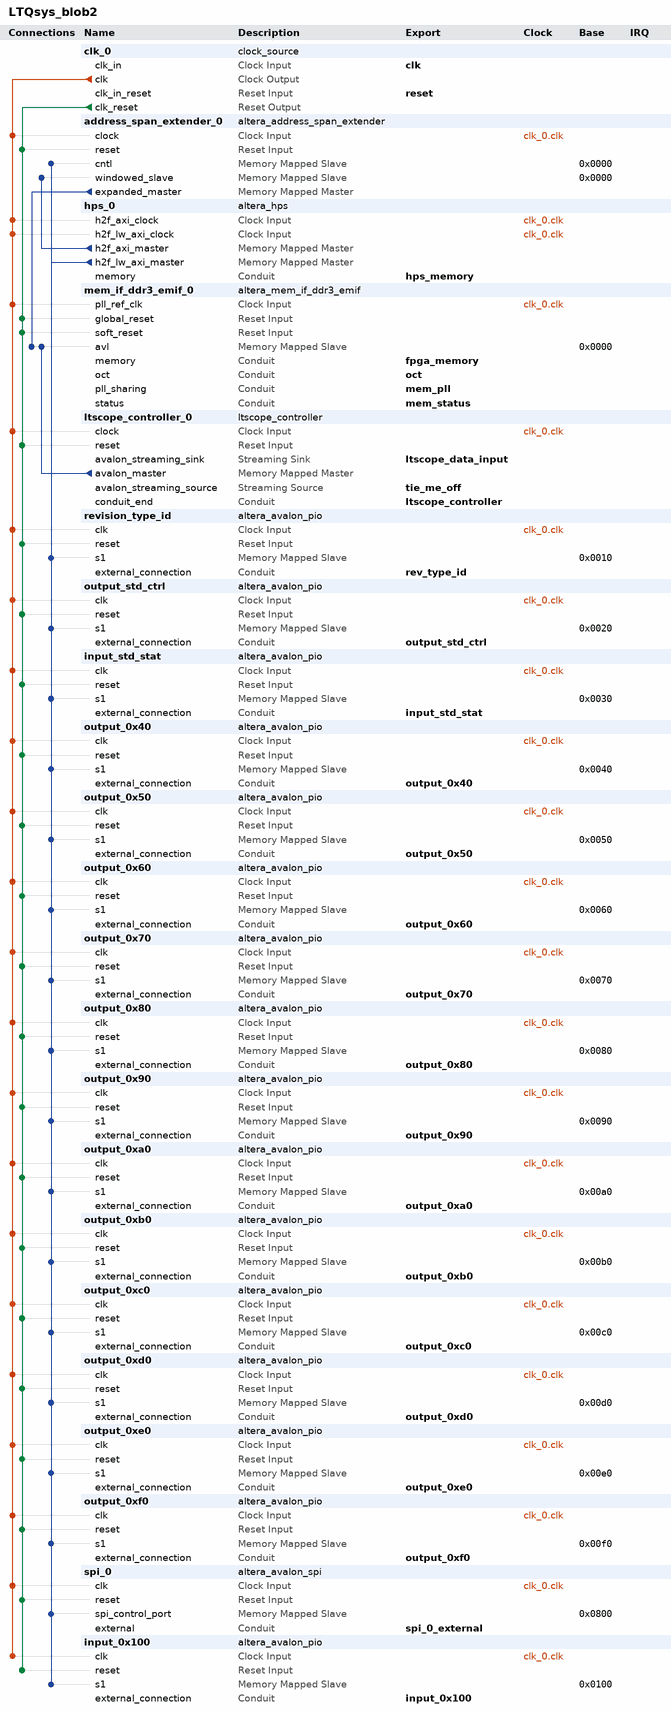
[diagram p0: system contents]
# Platform Designer (Qsys) system LTQsys_blob2, Cyclone V 5CSXFC6D6F31C8ES
# Parameters at their usual value, and those the tool derives, are not listed.
package require -exact qsys 14.1
create_system LTQsys_blob2
set_project_property DEVICE_FAMILY {Cyclone V}
set_project_property DEVICE 5CSXFC6D6F31C8ES

add_instance clk_0 clock_source 14.1
set_instance_parameter_value clk_0 clockFrequency 50000000

add_instance address_span_extender_0 altera_address_span_extender 14.1
set_instance_parameter_value address_span_extender_0 BURSTCOUNT_WIDTH 1
set_instance_parameter_value address_span_extender_0 DATA_WIDTH 32
set_instance_parameter_value address_span_extender_0 MASTER_ADDRESS_DEF 0
set_instance_parameter_value address_span_extender_0 MAX_PENDING_READS 1
set_instance_parameter_value address_span_extender_0 SLAVE_ADDRESS_WIDTH 26
set_instance_parameter_value address_span_extender_0 SUB_WINDOW_COUNT 2
set_instance_parameter_value address_span_extender_0 TERMINATE_SLAVE_PORT false

add_instance hps_0 altera_hps 14.1
set_instance_parameter_value hps_0 EMAC1_Mode N/A
set_instance_parameter_value hps_0 EMAC1_PinMuxing Unused
set_instance_parameter_value hps_0 F2SCLK_COLDRST_Enable false
set_instance_parameter_value hps_0 F2SCLK_DBGRST_Enable false
set_instance_parameter_value hps_0 F2SCLK_WARMRST_Enable false
set_instance_parameter_value hps_0 F2SINTERRUPT_Enable false
set_instance_parameter_value hps_0 F2S_Width 0
set_instance_parameter_value hps_0 FPGA_PERIPHERAL_OUTPUT_CLOCK_FREQ_EMAC0_GTX_CLK 100
set_instance_parameter_value hps_0 FPGA_PERIPHERAL_OUTPUT_CLOCK_FREQ_EMAC0_MD_CLK 100
set_instance_parameter_value hps_0 FPGA_PERIPHERAL_OUTPUT_CLOCK_FREQ_EMAC1_GTX_CLK 100
set_instance_parameter_value hps_0 FPGA_PERIPHERAL_OUTPUT_CLOCK_FREQ_EMAC1_MD_CLK 100
set_instance_parameter_value hps_0 HPS_PROTOCOL DDR3
set_instance_parameter_value hps_0 I2C0_Mode N/A
set_instance_parameter_value hps_0 I2C0_PinMuxing Unused
set_instance_parameter_value hps_0 I2C1_Mode N/A
set_instance_parameter_value hps_0 I2C1_PinMuxing Unused
set_instance_parameter_value hps_0 LWH2F_Enable true
set_instance_parameter_value hps_0 MEM_BANKADDR_WIDTH 3
set_instance_parameter_value hps_0 MEM_CLK_FREQ 400.0
set_instance_parameter_value hps_0 MEM_COL_ADDR_WIDTH 10
set_instance_parameter_value hps_0 MEM_DQ_WIDTH 32
set_instance_parameter_value hps_0 MEM_DRV_STR RZQ/7
set_instance_parameter_value hps_0 MEM_ROW_ADDR_WIDTH 15
set_instance_parameter_value hps_0 MEM_RTT_NOM RZQ/4
set_instance_parameter_value hps_0 MEM_RTT_WR RZQ/4
set_instance_parameter_value hps_0 MEM_TCL 11
set_instance_parameter_value hps_0 MEM_TFAW_NS 30.0
set_instance_parameter_value hps_0 MEM_TRAS_NS 35.0
set_instance_parameter_value hps_0 MEM_TRCD_NS 13.75
set_instance_parameter_value hps_0 MEM_TRFC_NS 260.0
set_instance_parameter_value hps_0 MEM_TRP_NS 13.75
set_instance_parameter_value hps_0 MEM_VENDOR JEDEC
set_instance_parameter_value hps_0 MEM_WTCL 8
set_instance_parameter_value hps_0 QSPI_Mode N/A
set_instance_parameter_value hps_0 QSPI_PinMuxing Unused
set_instance_parameter_value hps_0 REF_CLK_FREQ 25.0
set_instance_parameter_value hps_0 S2F_Width 2
set_instance_parameter_value hps_0 SDIO_Mode N/A
set_instance_parameter_value hps_0 SDIO_PinMuxing Unused
set_instance_parameter_value hps_0 SPIM1_Mode N/A
set_instance_parameter_value hps_0 SPIM1_PinMuxing Unused
set_instance_parameter_value hps_0 STM_Enable false
set_instance_parameter_value hps_0 TIMING_BOARD_AC_SKEW 0.03
set_instance_parameter_value hps_0 TIMING_BOARD_AC_TO_CK_SKEW 0.0
set_instance_parameter_value hps_0 TIMING_BOARD_DQ_TO_DQS_SKEW 0.0
set_instance_parameter_value hps_0 TIMING_BOARD_MAX_CK_DELAY 0.03
set_instance_parameter_value hps_0 TIMING_BOARD_MAX_DQS_DELAY 0.02
set_instance_parameter_value hps_0 TIMING_BOARD_SKEW_BETWEEN_DQS 0.08
set_instance_parameter_value hps_0 TIMING_BOARD_SKEW_CKDQS_DIMM_MAX 0.16
set_instance_parameter_value hps_0 TIMING_BOARD_SKEW_CKDQS_DIMM_MIN 0.09
set_instance_parameter_value hps_0 TIMING_BOARD_SKEW_WITHIN_DQS 0.01
set_instance_parameter_value hps_0 TIMING_TDH 65
set_instance_parameter_value hps_0 TIMING_TDQSCK 255
set_instance_parameter_value hps_0 TIMING_TDQSQ 125
set_instance_parameter_value hps_0 TIMING_TDS 30
set_instance_parameter_value hps_0 TIMING_TIH 140
set_instance_parameter_value hps_0 TIMING_TIS 180
set_instance_parameter_value hps_0 TIMING_TQSH 0.4
set_instance_parameter_value hps_0 UART0_Mode N/A
set_instance_parameter_value hps_0 UART0_PinMuxing Unused
set_instance_parameter_value hps_0 USB1_Mode N/A
set_instance_parameter_value hps_0 USB1_PinMuxing Unused
set_instance_parameter_value hps_0 desired_cfg_clk_mhz 100.0
set_instance_parameter_value hps_0 desired_qspi_clk_mhz 400.0

add_instance mem_if_ddr3_emif_0 altera_mem_if_ddr3_emif 14.1
set_instance_parameter_value mem_if_ddr3_emif_0 AVL_MAX_SIZE 4
set_instance_parameter_value mem_if_ddr3_emif_0 CALIBRATION_MODE Full
set_instance_parameter_value mem_if_ddr3_emif_0 CPORT_TYPE_PORT Bidirectional,Bidirectional,Bidirectional,Bidirectional,Bidirectional,Bidirectional
set_instance_parameter_value mem_if_ddr3_emif_0 EXPORT_AFI_HALF_CLK false
set_instance_parameter_value mem_if_ddr3_emif_0 HARD_EMIF false
set_instance_parameter_value mem_if_ddr3_emif_0 MEM_BANKADDR_WIDTH 3
set_instance_parameter_value mem_if_ddr3_emif_0 MEM_CLK_FREQ 300.0
set_instance_parameter_value mem_if_ddr3_emif_0 MEM_CLK_FREQ_MAX 400.0
set_instance_parameter_value mem_if_ddr3_emif_0 MEM_COL_ADDR_WIDTH 10
set_instance_parameter_value mem_if_ddr3_emif_0 MEM_DQ_WIDTH 32
set_instance_parameter_value mem_if_ddr3_emif_0 MEM_FORMAT DISCRETE
set_instance_parameter_value mem_if_ddr3_emif_0 MEM_ROW_ADDR_WIDTH 15
set_instance_parameter_value mem_if_ddr3_emif_0 MEM_TCL 6
set_instance_parameter_value mem_if_ddr3_emif_0 MEM_TFAW_NS 50.0
set_instance_parameter_value mem_if_ddr3_emif_0 MEM_TRAS_NS 37.5
set_instance_parameter_value mem_if_ddr3_emif_0 MEM_TRCD_NS 15.0
set_instance_parameter_value mem_if_ddr3_emif_0 MEM_TRFC_NS 300.0
set_instance_parameter_value mem_if_ddr3_emif_0 MEM_TRP_NS 15.0
set_instance_parameter_value mem_if_ddr3_emif_0 MEM_TRRD_NS 13.2
set_instance_parameter_value mem_if_ddr3_emif_0 MEM_TRTP_NS 13.2
set_instance_parameter_value mem_if_ddr3_emif_0 MEM_TWTR 4
set_instance_parameter_value mem_if_ddr3_emif_0 MEM_VENDOR JEDEC
set_instance_parameter_value mem_if_ddr3_emif_0 MEM_WTCL 5
set_instance_parameter_value mem_if_ddr3_emif_0 PLL_LOCATION Top_Bottom
set_instance_parameter_value mem_if_ddr3_emif_0 POWER_OF_TWO_BUS false
set_instance_parameter_value mem_if_ddr3_emif_0 PRIORITY_PORT 1,1,1,1,1,1
set_instance_parameter_value mem_if_ddr3_emif_0 RATE Half
set_instance_parameter_value mem_if_ddr3_emif_0 REF_CLK_FREQ 50.0
set_instance_parameter_value mem_if_ddr3_emif_0 SPEED_GRADE 8
set_instance_parameter_value mem_if_ddr3_emif_0 TIMING_BOARD_AC_SKEW 0.03
set_instance_parameter_value mem_if_ddr3_emif_0 TIMING_BOARD_AC_TO_CK_SKEW 0.0
set_instance_parameter_value mem_if_ddr3_emif_0 TIMING_BOARD_DQ_TO_DQS_SKEW 0.0
set_instance_parameter_value mem_if_ddr3_emif_0 TIMING_BOARD_MAX_CK_DELAY 0.03
set_instance_parameter_value mem_if_ddr3_emif_0 TIMING_BOARD_MAX_DQS_DELAY 0.03
set_instance_parameter_value mem_if_ddr3_emif_0 TIMING_BOARD_SKEW_BETWEEN_DQS 0.08
set_instance_parameter_value mem_if_ddr3_emif_0 TIMING_BOARD_SKEW_CKDQS_DIMM_MAX 0.0
set_instance_parameter_value mem_if_ddr3_emif_0 TIMING_BOARD_SKEW_CKDQS_DIMM_MIN 0.0
set_instance_parameter_value mem_if_ddr3_emif_0 TIMING_BOARD_SKEW_WITHIN_DQS 0.01
set_instance_parameter_value mem_if_ddr3_emif_0 TIMING_TDH 150
set_instance_parameter_value mem_if_ddr3_emif_0 TIMING_TDQSCK 400
set_instance_parameter_value mem_if_ddr3_emif_0 TIMING_TDQSQ 200
set_instance_parameter_value mem_if_ddr3_emif_0 TIMING_TDQSS 0.25
set_instance_parameter_value mem_if_ddr3_emif_0 TIMING_TDS 75
set_instance_parameter_value mem_if_ddr3_emif_0 TIMING_TDSH 0.2
set_instance_parameter_value mem_if_ddr3_emif_0 TIMING_TDSS 0.2
set_instance_parameter_value mem_if_ddr3_emif_0 TIMING_TIH 275
set_instance_parameter_value mem_if_ddr3_emif_0 TIMING_TIS 200
set_instance_parameter_value mem_if_ddr3_emif_0 TIMING_TQSH 0.38
set_instance_parameter_value mem_if_ddr3_emif_0 USER_DEBUG_LEVEL 1

add_instance ltscope_controller_0 ltscope_controller 2.0
set_instance_parameter_value ltscope_controller_0 ADDRESS_DEPTH 29

add_instance revision_type_id altera_avalon_pio 14.1
set_instance_parameter_value revision_type_id direction Input
set_instance_parameter_value revision_type_id width 32

add_instance output_std_ctrl altera_avalon_pio 14.1
set_instance_parameter_value output_std_ctrl direction Output
set_instance_parameter_value output_std_ctrl width 32

add_instance input_std_stat altera_avalon_pio 14.1
set_instance_parameter_value input_std_stat direction Input
set_instance_parameter_value input_std_stat width 32

add_instance output_0x40 altera_avalon_pio 14.1
set_instance_parameter_value output_0x40 direction Output
set_instance_parameter_value output_0x40 width 32

add_instance output_0x50 altera_avalon_pio 14.1
set_instance_parameter_value output_0x50 direction Output
set_instance_parameter_value output_0x50 width 32

add_instance output_0x60 altera_avalon_pio 14.1
set_instance_parameter_value output_0x60 direction Output
set_instance_parameter_value output_0x60 width 32

add_instance output_0x70 altera_avalon_pio 14.1
set_instance_parameter_value output_0x70 direction Output
set_instance_parameter_value output_0x70 width 32

add_instance output_0x80 altera_avalon_pio 14.1
set_instance_parameter_value output_0x80 direction Output
set_instance_parameter_value output_0x80 width 32

add_instance output_0x90 altera_avalon_pio 14.1
set_instance_parameter_value output_0x90 direction Output
set_instance_parameter_value output_0x90 width 32

add_instance output_0xa0 altera_avalon_pio 14.1
set_instance_parameter_value output_0xa0 direction Output
set_instance_parameter_value output_0xa0 width 32

add_instance output_0xb0 altera_avalon_pio 14.1
set_instance_parameter_value output_0xb0 direction Output
set_instance_parameter_value output_0xb0 width 32

add_instance output_0xc0 altera_avalon_pio 14.1
set_instance_parameter_value output_0xc0 direction Output
set_instance_parameter_value output_0xc0 width 32

add_instance output_0xd0 altera_avalon_pio 14.1
set_instance_parameter_value output_0xd0 direction Output
set_instance_parameter_value output_0xd0 width 32

add_instance output_0xe0 altera_avalon_pio 14.1
set_instance_parameter_value output_0xe0 direction Output
set_instance_parameter_value output_0xe0 width 32

add_instance output_0xf0 altera_avalon_pio 14.1
set_instance_parameter_value output_0xf0 direction Output
set_instance_parameter_value output_0xf0 resetValue 214748
set_instance_parameter_value output_0xf0 width 32

add_instance spi_0 altera_avalon_spi 14.1
set_instance_parameter_value spi_0 clockPolarity 0
set_instance_parameter_value spi_0 dataWidth 8
set_instance_parameter_value spi_0 masterSPI true
set_instance_parameter_value spi_0 numberOfSlaves 8
set_instance_parameter_value spi_0 targetClockRate 500000
set_instance_parameter_value spi_0 targetSlaveSelectToSClkDelay 1000.0

add_instance input_0x100 altera_avalon_pio 14.1
set_instance_parameter_value input_0x100 direction Input
set_instance_parameter_value input_0x100 width 32

# connections
add_connection clk_0.clk address_span_extender_0.clock clock
add_connection clk_0.clk hps_0.h2f_axi_clock clock
add_connection clk_0.clk hps_0.h2f_lw_axi_clock clock
add_connection clk_0.clk input_0x100.clk clock
add_connection clk_0.clk input_std_stat.clk clock
add_connection clk_0.clk ltscope_controller_0.clock clock
add_connection clk_0.clk mem_if_ddr3_emif_0.pll_ref_clk clock
add_connection clk_0.clk output_0x40.clk clock
add_connection clk_0.clk output_0x50.clk clock
add_connection clk_0.clk output_0x60.clk clock
add_connection clk_0.clk output_0x70.clk clock
add_connection clk_0.clk output_0x80.clk clock
add_connection clk_0.clk output_0x90.clk clock
add_connection clk_0.clk output_0xa0.clk clock
add_connection clk_0.clk output_0xb0.clk clock
add_connection clk_0.clk output_0xc0.clk clock
add_connection clk_0.clk output_0xd0.clk clock
add_connection clk_0.clk output_0xe0.clk clock
add_connection clk_0.clk output_0xf0.clk clock
add_connection clk_0.clk output_std_ctrl.clk clock
add_connection clk_0.clk revision_type_id.clk clock
add_connection clk_0.clk spi_0.clk clock
add_connection clk_0.clk_reset address_span_extender_0.reset reset
add_connection clk_0.clk_reset input_0x100.reset reset
add_connection clk_0.clk_reset input_std_stat.reset reset
add_connection clk_0.clk_reset ltscope_controller_0.reset reset
add_connection clk_0.clk_reset mem_if_ddr3_emif_0.global_reset reset
add_connection clk_0.clk_reset mem_if_ddr3_emif_0.soft_reset reset
add_connection clk_0.clk_reset output_0x40.reset reset
add_connection clk_0.clk_reset output_0x50.reset reset
add_connection clk_0.clk_reset output_0x60.reset reset
add_connection clk_0.clk_reset output_0x70.reset reset
add_connection clk_0.clk_reset output_0x80.reset reset
add_connection clk_0.clk_reset output_0x90.reset reset
add_connection clk_0.clk_reset output_0xa0.reset reset
add_connection clk_0.clk_reset output_0xb0.reset reset
add_connection clk_0.clk_reset output_0xc0.reset reset
add_connection clk_0.clk_reset output_0xd0.reset reset
add_connection clk_0.clk_reset output_0xe0.reset reset
add_connection clk_0.clk_reset output_0xf0.reset reset
add_connection clk_0.clk_reset output_std_ctrl.reset reset
add_connection clk_0.clk_reset revision_type_id.reset reset
add_connection clk_0.clk_reset spi_0.reset reset
add_connection address_span_extender_0.expanded_master mem_if_ddr3_emif_0.avl avalon
set_connection_parameter_value address_span_extender_0.expanded_master/mem_if_ddr3_emif_0.avl baseAddress 0x0000
add_connection hps_0.h2f_axi_master address_span_extender_0.windowed_slave avalon
set_connection_parameter_value hps_0.h2f_axi_master/address_span_extender_0.windowed_slave baseAddress 0x0000
add_connection hps_0.h2f_lw_axi_master address_span_extender_0.cntl avalon
set_connection_parameter_value hps_0.h2f_lw_axi_master/address_span_extender_0.cntl baseAddress 0x0000
add_connection hps_0.h2f_lw_axi_master input_0x100.s1 avalon
set_connection_parameter_value hps_0.h2f_lw_axi_master/input_0x100.s1 baseAddress 0x0100
add_connection hps_0.h2f_lw_axi_master input_std_stat.s1 avalon
set_connection_parameter_value hps_0.h2f_lw_axi_master/input_std_stat.s1 baseAddress 0x0030
add_connection hps_0.h2f_lw_axi_master output_0x40.s1 avalon
set_connection_parameter_value hps_0.h2f_lw_axi_master/output_0x40.s1 baseAddress 0x0040
add_connection hps_0.h2f_lw_axi_master output_0x50.s1 avalon
set_connection_parameter_value hps_0.h2f_lw_axi_master/output_0x50.s1 baseAddress 0x0050
add_connection hps_0.h2f_lw_axi_master output_0x60.s1 avalon
set_connection_parameter_value hps_0.h2f_lw_axi_master/output_0x60.s1 baseAddress 0x0060
add_connection hps_0.h2f_lw_axi_master output_0x70.s1 avalon
set_connection_parameter_value hps_0.h2f_lw_axi_master/output_0x70.s1 baseAddress 0x0070
add_connection hps_0.h2f_lw_axi_master output_0x80.s1 avalon
set_connection_parameter_value hps_0.h2f_lw_axi_master/output_0x80.s1 baseAddress 0x0080
add_connection hps_0.h2f_lw_axi_master output_0x90.s1 avalon
set_connection_parameter_value hps_0.h2f_lw_axi_master/output_0x90.s1 baseAddress 0x0090
add_connection hps_0.h2f_lw_axi_master output_0xa0.s1 avalon
set_connection_parameter_value hps_0.h2f_lw_axi_master/output_0xa0.s1 baseAddress 0x00a0
add_connection hps_0.h2f_lw_axi_master output_0xb0.s1 avalon
set_connection_parameter_value hps_0.h2f_lw_axi_master/output_0xb0.s1 baseAddress 0x00b0
add_connection hps_0.h2f_lw_axi_master output_0xc0.s1 avalon
set_connection_parameter_value hps_0.h2f_lw_axi_master/output_0xc0.s1 baseAddress 0x00c0
add_connection hps_0.h2f_lw_axi_master output_0xd0.s1 avalon
set_connection_parameter_value hps_0.h2f_lw_axi_master/output_0xd0.s1 baseAddress 0x00d0
add_connection hps_0.h2f_lw_axi_master output_0xe0.s1 avalon
set_connection_parameter_value hps_0.h2f_lw_axi_master/output_0xe0.s1 baseAddress 0x00e0
add_connection hps_0.h2f_lw_axi_master output_0xf0.s1 avalon
set_connection_parameter_value hps_0.h2f_lw_axi_master/output_0xf0.s1 baseAddress 0x00f0
add_connection hps_0.h2f_lw_axi_master output_std_ctrl.s1 avalon
set_connection_parameter_value hps_0.h2f_lw_axi_master/output_std_ctrl.s1 baseAddress 0x0020
add_connection hps_0.h2f_lw_axi_master revision_type_id.s1 avalon
set_connection_parameter_value hps_0.h2f_lw_axi_master/revision_type_id.s1 baseAddress 0x0010
add_connection hps_0.h2f_lw_axi_master spi_0.spi_control_port avalon
set_connection_parameter_value hps_0.h2f_lw_axi_master/spi_0.spi_control_port baseAddress 0x0800
add_connection ltscope_controller_0.avalon_master mem_if_ddr3_emif_0.avl avalon
set_connection_parameter_value ltscope_controller_0.avalon_master/mem_if_ddr3_emif_0.avl baseAddress 0x0000

# exported interfaces
add_interface clk clock sink
set_interface_property clk EXPORT_OF clk_0.clk_in
add_interface fpga_memory conduit end
set_interface_property fpga_memory EXPORT_OF mem_if_ddr3_emif_0.memory
add_interface hps_memory conduit end
set_interface_property hps_memory EXPORT_OF hps_0.memory
add_interface input_0x100 conduit end
set_interface_property input_0x100 EXPORT_OF input_0x100.external_connection
add_interface input_std_stat conduit end
set_interface_property input_std_stat EXPORT_OF input_std_stat.external_connection
add_interface ltscope_controller conduit end
set_interface_property ltscope_controller EXPORT_OF ltscope_controller_0.conduit_end
add_interface ltscope_data_input avalon_streaming sink
set_interface_property ltscope_data_input EXPORT_OF ltscope_controller_0.avalon_streaming_sink
add_interface mem_pll conduit end
set_interface_property mem_pll EXPORT_OF mem_if_ddr3_emif_0.pll_sharing
add_interface mem_status conduit end
set_interface_property mem_status EXPORT_OF mem_if_ddr3_emif_0.status
add_interface oct conduit end
set_interface_property oct EXPORT_OF mem_if_ddr3_emif_0.oct
add_interface output_0x40 conduit end
set_interface_property output_0x40 EXPORT_OF output_0x40.external_connection
add_interface output_0x50 conduit end
set_interface_property output_0x50 EXPORT_OF output_0x50.external_connection
add_interface output_0x60 conduit end
set_interface_property output_0x60 EXPORT_OF output_0x60.external_connection
add_interface output_0x70 conduit end
set_interface_property output_0x70 EXPORT_OF output_0x70.external_connection
add_interface output_0x80 conduit end
set_interface_property output_0x80 EXPORT_OF output_0x80.external_connection
add_interface output_0x90 conduit end
set_interface_property output_0x90 EXPORT_OF output_0x90.external_connection
add_interface output_0xa0 conduit end
set_interface_property output_0xa0 EXPORT_OF output_0xa0.external_connection
add_interface output_0xb0 conduit end
set_interface_property output_0xb0 EXPORT_OF output_0xb0.external_connection
add_interface output_0xc0 conduit end
set_interface_property output_0xc0 EXPORT_OF output_0xc0.external_connection
add_interface output_0xd0 conduit end
set_interface_property output_0xd0 EXPORT_OF output_0xd0.external_connection
add_interface output_0xe0 conduit end
set_interface_property output_0xe0 EXPORT_OF output_0xe0.external_connection
add_interface output_0xf0 conduit end
set_interface_property output_0xf0 EXPORT_OF output_0xf0.external_connection
add_interface output_std_ctrl conduit end
set_interface_property output_std_ctrl EXPORT_OF output_std_ctrl.external_connection
add_interface reset reset sink
set_interface_property reset EXPORT_OF clk_0.clk_in_reset
add_interface rev_type_id conduit end
set_interface_property rev_type_id EXPORT_OF revision_type_id.external_connection
add_interface spi_0_external conduit end
set_interface_property spi_0_external EXPORT_OF spi_0.external
add_interface tie_me_off avalon_streaming source
set_interface_property tie_me_off EXPORT_OF ltscope_controller_0.avalon_streaming_source

set_interconnect_requirement {$system} qsys_mm.clockCrossingAdapter HANDSHAKE
set_interconnect_requirement {$system} qsys_mm.insertDefaultSlave false
set_interconnect_requirement {$system} qsys_mm.maxAdditionalLatency 1

save_system LTQsys_blob2.qsys
